# Altium schematic sheet robotShield_USB.SchDoc
size A4; SheetNumber: 3; SheetTotal: 6
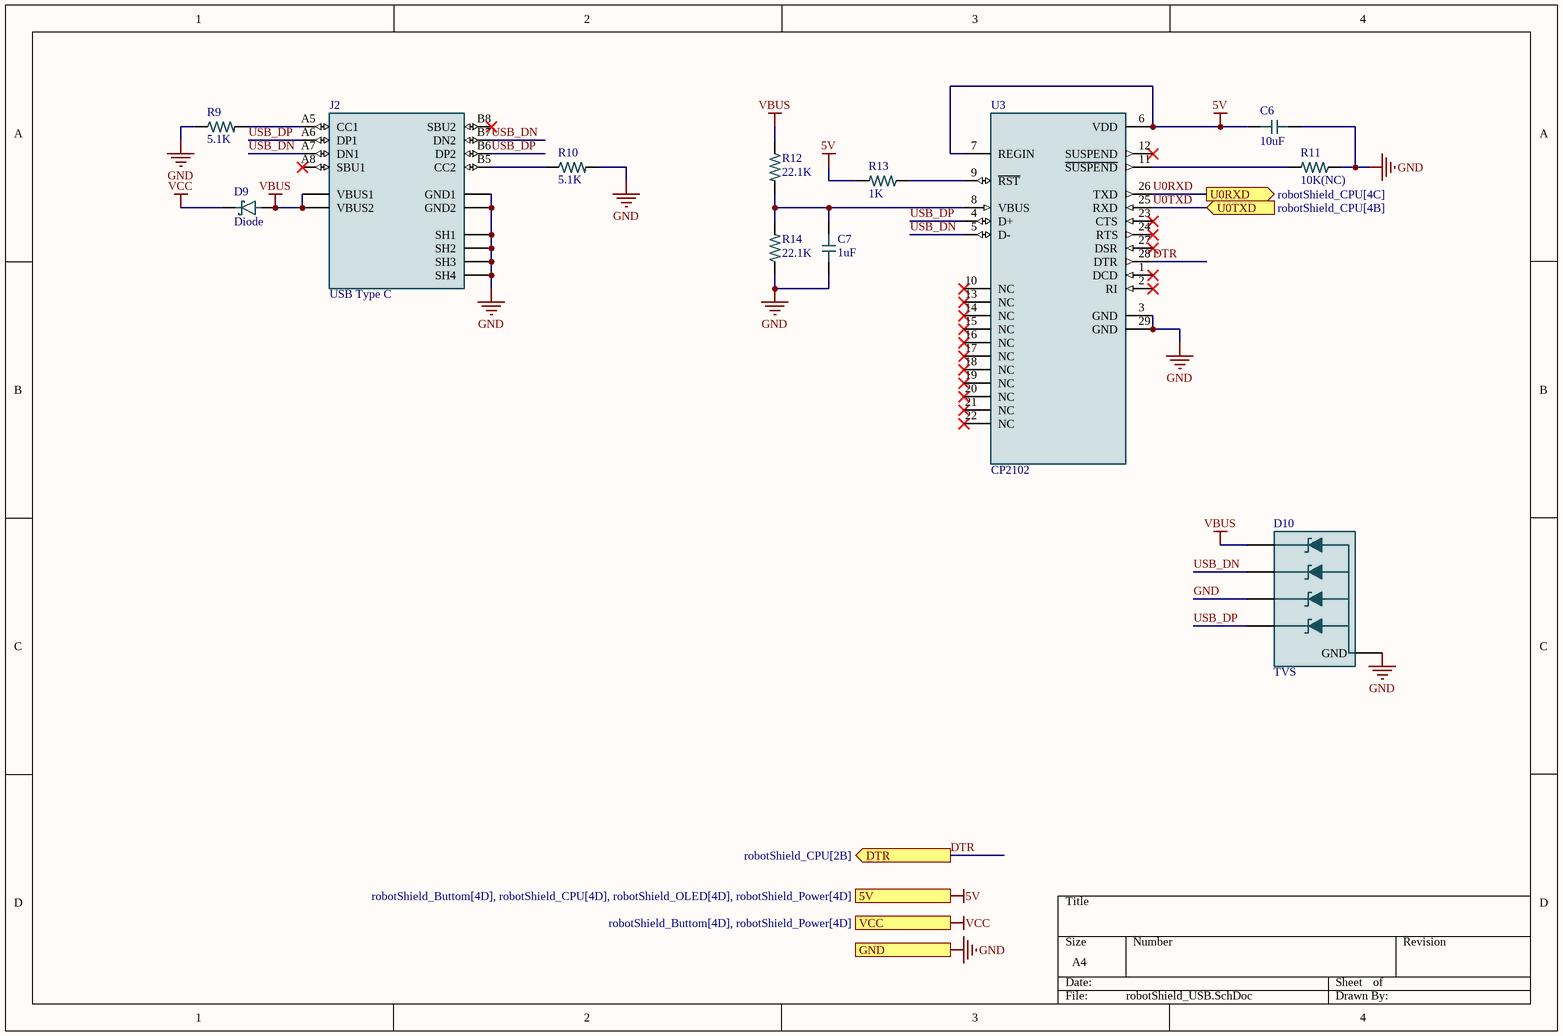
[diagram p0: robotShield_USB.SchDoc]

## Parts
C6  10uF  [CAP0603]
C7  1uF  [CAP0603]
D9  Diode  [MBR0520LT3G]
D10  TVS  [TVS-SE05T1D12GZ]
J2  USB Type C  [USB_Type_C_16pin]
R9  5.1K  [RES0603]
R10  5.1K  [RES0603]
R11  10K(NC)  [RES0603]
R12  22.1K  [RES0603]
R13  1K  [RES0603]
R14  22.1K  [RES0603]
U3  CP2102  [CP2102]

## Ports
5V (see robotShield_Buttom[4D], robotShield_CPU[4D], robotShield_OLED[4D], robotShield_Power[4D]), DTR (out, see robotShield_CPU[2B]), GND (see robotShield_Buttom[4D], robotShield_CPU[4D], robotShield_OLED[4D], robotShield_Power[4D]), U0RXD (out, see robotShield_CPU[4C]), U0TXD (in, see robotShield_CPU[4B]), VCC (see robotShield_Buttom[4D], robotShield_Power[4D])

## Nets
5V: C6.1 R13.2 U3.6(VDD) U3.7(REGIN) ; port 5V
GND: C6.2 C7.2 D10.3(GND) D10.4(I/O_4) J2.A1B12(GND1) J2.B1A12(GND2) J2.SH1 J2.SH2 J2.SH3 J2.SH4 R9.1 R10.2 R11.1 R14.1 U3.3(GND) U3.29(GND) ; port GND
VBUS: D9.A D10.1(I/O_1) J2.A4B9(VBUS1) J2.B4A9(VBUS2) R12.1
VCC: D9.C(K) ; port VCC
DTR: U3.28(DTR) ; port DTR
U0RXD: U3.26(TXD) ; port U0RXD
U0TXD: U3.25(RXD) ; port U0TXD
USB_DN: D10.2(I/O_2) J2.A7(DN1) J2.B7(DN2) U3.5(D-)
USB_DP: D10.5(I/O_5) J2.A6(DP1) J2.B6(DP2) U3.4(D+)
NetC7_1: C7.1 R12.2 R14.2 U3.8(VBUS)
NetJ2_A5: J2.A5(CC1) R9.2
NetJ2_B5: J2.B5(CC2) R10.1
NetR11_2: R11.2 U3.11(~{SUSPEND})
NetR13_1: R13.1 U3.9(~{RST})

Not connected (* = marked no-connect by the designer): J2 A8(SBU1)* B8(SBU2)*; U3 1(DCD)* 2(RI)* 10(NC)* 12(SUSPEND)* 13(NC)* 14(NC)* 15(NC)* 16(NC)* 17(NC)* 18(NC)* 19(NC)* 20(NC)* 21(NC)* 22(NC)* 23(CTS)* 24(RTS)* 27(DSR)*

## Library data of the parts
C6 C7 = Capacitor: CAP SMD; MF: AVX; MP: LD031A101GAB2A; SnapEDA_Link: https://www.snapeda.com/parts/LD031A101GAB2A/AVX/view-part/1973966/?ref=snap; Price: None; Availability: Unavailable; Package: 0603 AVX; Value: *
D9 = Schottky Diode: MF: Diotec Semiconductor; MP: S1M; Value: *; Price: None; Package: DO-214AC-2 Diotec; Availability: In Stock; SnapEDA_Link: https://www.snapeda.com/parts/S1M/Diotec/view-part/?ref=snap; Purchase-URL: https://pricing.snapeda.com/search/part/S1M/?ref=eda; Check_prices: https://www.snapeda.com/parts/S1M/Diotec/view-part/?ref=eda
D10 = TVS_SE05NRC14GT: ESD8104MUTAG, Quad Uni-Directional ESD Protection Diode, 10-Pin UDFN; MF: ON Semiconductor; MP: ESD8104MUTAG; Availability: Unavailable; Price: None; SnapEDA_Link: https://www.snapeda.com/parts/ESD8104MUTAG/ON%20Semiconductor/view-part/220668/?ref=snap; Package: UDFN-10 ON Semiconductor; Value: *; DigiKey-Purchase-URL: https://snapeda.com/shop?store=DigiKey&id=220668
J2 = USB_Type_C _16pin: USB Type C - Connector, Top-mount SMT, 16pos | Molex Incorporated 217179-0001; SnapEDA_Link: https://www.snapeda.com/parts/217179-0001/Molex/view-part/?ref=snap; Package: None; Value: *; MF: Molex; MP: 217179-0001; Check_prices: https://www.snapeda.com/parts/217179-0001/Molex/view-part/?ref=eda; ComponentLink1Description: link; ComponentLink1URL: https://roboeq.ir/products/detail/1501044/کانکتور-USB-Type-C-مادگی-16-پین-SMD/
R9-R14 = Resistor: RES 0.27 OHM 1% 1/10W; Power_Rating: .1 W; MP: 3-1879460-5; Resistance: 27; MF: TE Connectivity; SnapEDA_Link: https://www.snapeda.com/parts/3-1879460-5/TE+Connectivity/view-part/?ref=snap; Package: 0603; Check_prices: https://www.snapeda.com/parts/3-1879460-5/TE+Connectivity/view-part/?ref=eda; EU_RoHS_Compliance: Compliant with Exemptions; Price: None; Tolerance: 1%; Availability: In Stock; Value: *
U3 = CP2102: CP2102N USB 2.0 to UART (RS232) Bridge Interface Evaluation Board; MF: Silicon Labs; Purchase-URL: https://pricing.snapeda.com/search/part/CP2102/?ref=eda; Package: WFQFN-20 Silicon Labs; Value: *; Check_prices: https://www.snapeda.com/parts/CP2102/Silicon+Labs/view-part/?ref=eda; SnapEDA_Link: https://www.snapeda.com/parts/CP2102/Silicon+Labs/view-part/?ref=snap; Availability: In Stock; Price: None; MP: CP2102